# EAGLE design untitled (EAGLE 5.06)
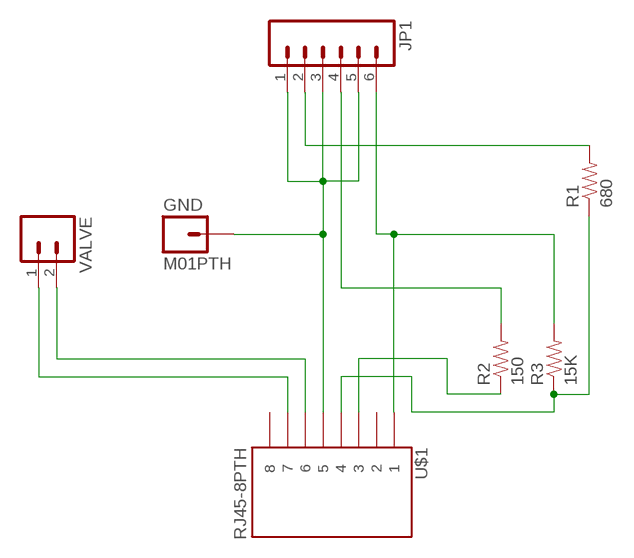
[diagram p0: schematic, sheet 1]

## Parts
GND  M01PTH  [1X01]
JP1  M063.5MM-6  [SCREWTERMINAL-3.5MM-6]
R1  680  RESISTORPTH-1/4W  [AXIAL-0.4]
R2  150  RESISTORPTH-1/4W  [AXIAL-0.4]
R3  15K  RESISTORPTH-1/4W  [AXIAL-0.4]
U$1  RJ45-8PTH  [RJ45-8]
VALVE  M023.5MM_LOCK  [SCREWTERMINAL-3.5MM-2_LOCK]

## Nets
N$1: JP1.6 R3.P$2 U$1.1
N$2: R1.P$1 R3.P$1 U$1.4
N$3: JP1.2 R1.P$2
N$4: GND.1 JP1.1 JP1.3 JP1.5 U$1.5
N$5: U$1.6 VALVE.2
N$6: U$1.7 VALVE.1
N$7: JP1.4 R2.P$2
N$8: R2.P$1 U$1.3
Unconnected: U$1.2 U$1.8

## Library data of the parts
GND = SparkFun:M01: Header 1 Standard 1-pin 0.1" header. Use with straight break away headers (SKU : PRT-00116), right angle break away headers (PRT-00553), swiss pins (PRT-00743), machine pins (PRT-00117), and female headers (PRT-00115).
JP1 = SparkFun:M06: Header 6 Standard 6-pin 0.1" header. Use with straight break away headers (SKU : PRT-00116), right angle break away headers (PRT-00553), swiss pins (PRT-00743), machine pins (PRT-00117), and female headers (PRT-00115). Molex polarized connector foot print use with SKU : PRT-08094 with associated crimp pins and housings. NOTES ON THE VARIANTS LOCK and LOCK_LONGPADS... This footprint was designed to help hold the alignment of a through-hole component (i.e. 6-pin header) while soldering it into place. You may notice that each hole has been shifted either up or down by 0.005 of an inch from it's more standard position (which is a perfectly straight line). This slight alteration caused the pins (the squares in the middle) to touch the edges of the holes. Because they are alternating, it causes a "brace" to hold the component in place. 0.005 has proven to be the perfect amount of "off-center" position when using our standard breakaway headers. Although looks a little odd when you look at the bare footprint, once you have a header in there, the alteration is very hard to notice. Also, if you push a header all the way into place, it is covered up entirely on the bottom side. This idea of altering the position of holes to aid alignment will be further integrated into the Sparkfun Library for other footprints. It can help hold any component with 3 or more connection pins.
R1-R3 = SparkFun:RESISTOR: Resistor Basic schematic elements and footprints for 0603, 1206, and PTH resistors.
U$1 = SparkFun:RJ45-8: RJ45 Jack Simple RJ45, 8-pin connection - connector for common Cat5, Cat5e, and Cat6 Ethernet cables. Footprint not yet proven in production. Connector sku is PRT-00643; Breakout PCB sku is BOB-00716.
VALVE = SparkFun:M02: Header 2 Standard 2-pin 0.1" header. Use with straight break away headers (SKU : PRT-00116), right angle break away headers (PRT-00553), swiss pins (PRT-00743), machine pins (PRT-00117), and female headers (PRT-00115). Molex polarized connector foot print use with SKU : PRT-08233 with associated crimp pins and housings.

## Board
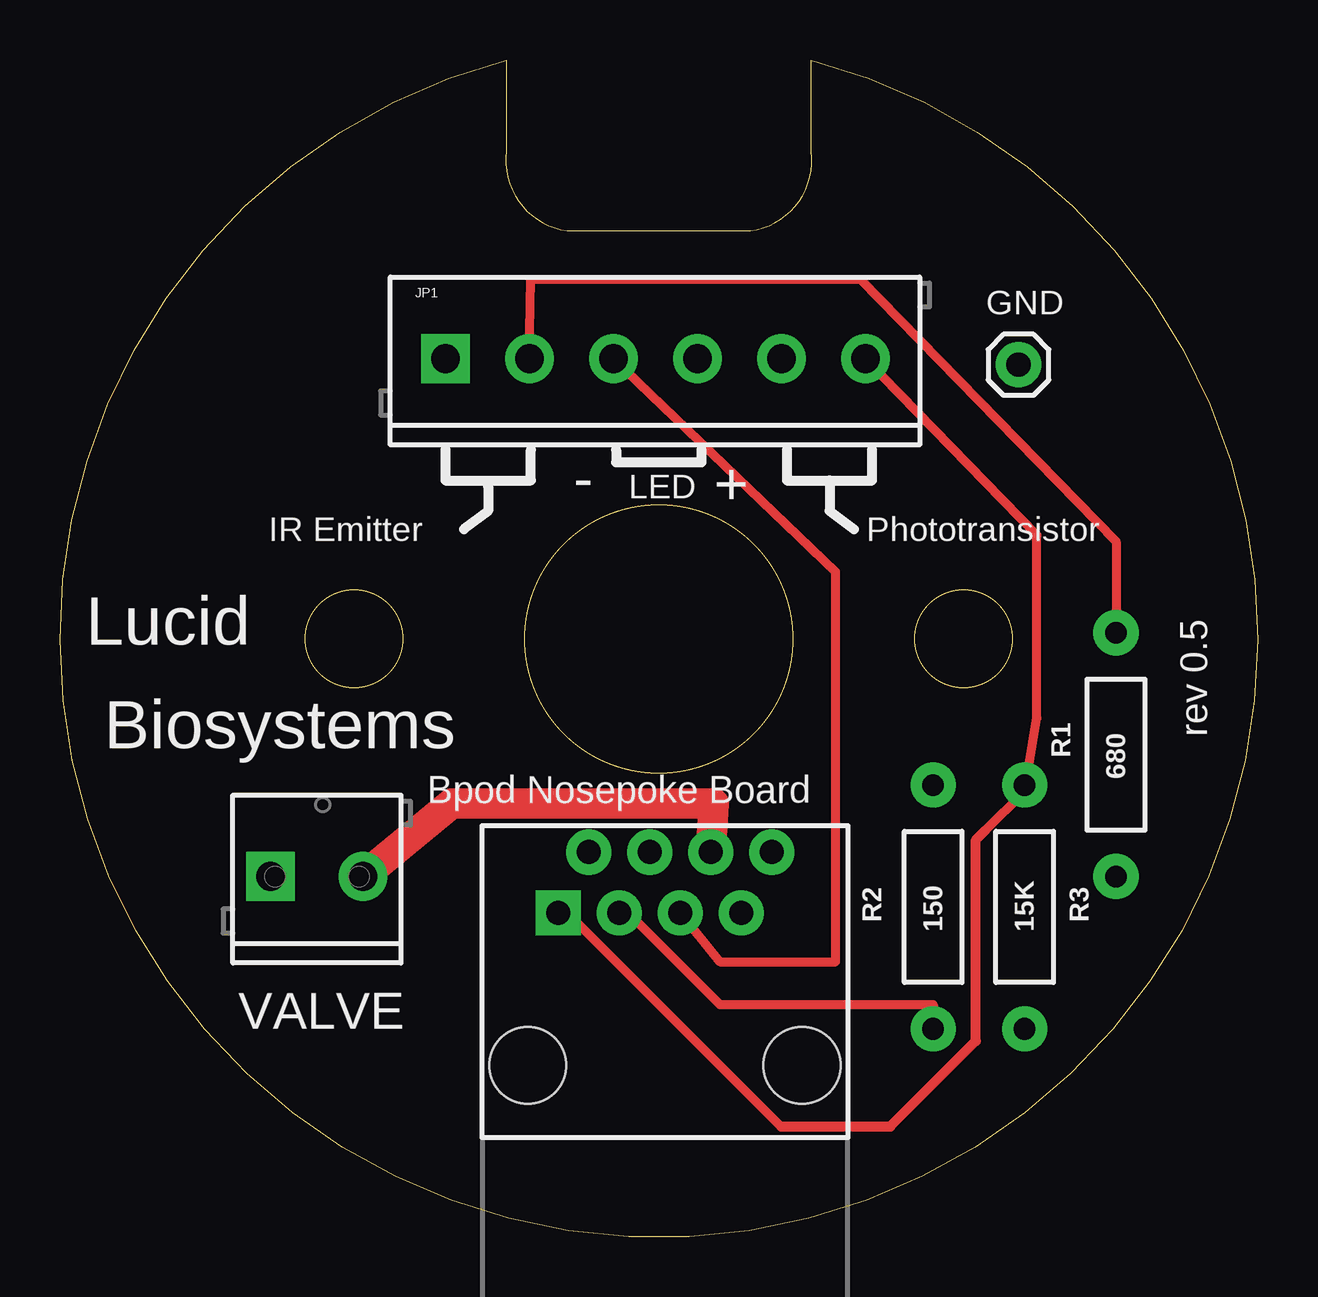
[diagram p1: board, top side]
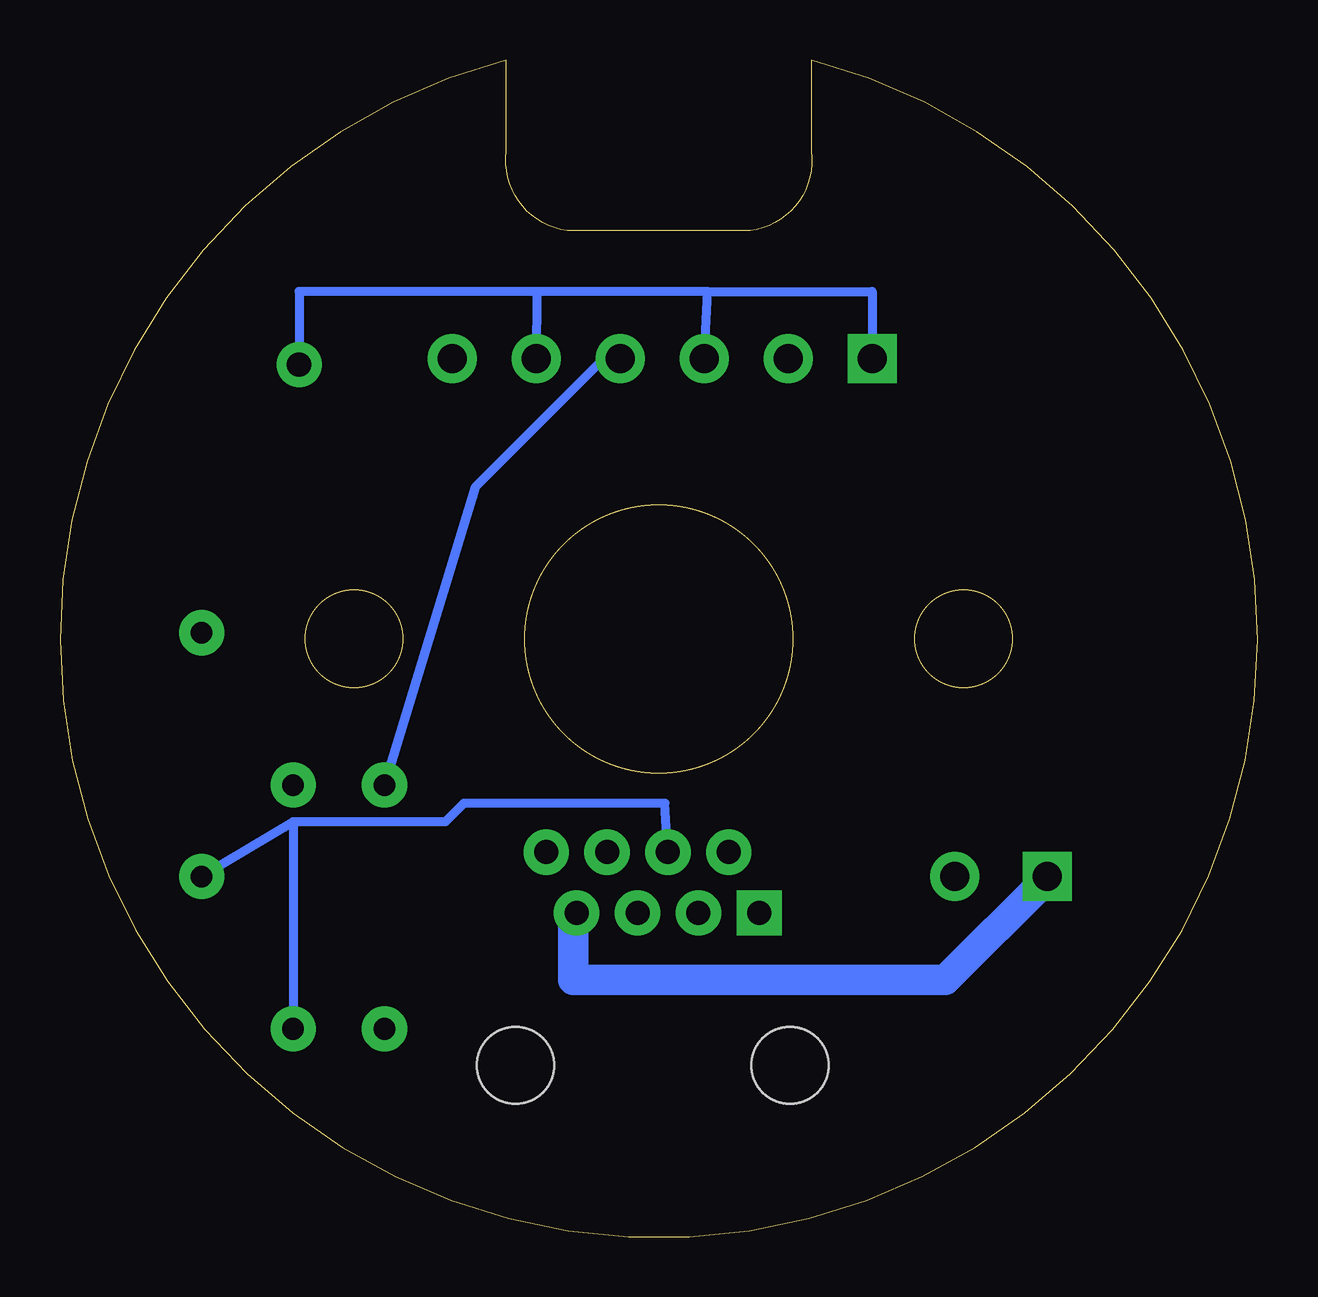
[diagram p2: board, bottom side, seen from below]

Size 49.9 x 49.05 mm. Coordinates in mm from the lower left corner, seen from the top.
Outline: 31.3,49.05 arc-331 18.6,49.05 18.6,45.24 arc90 21.14,41.94 28.76,41.94 arc90 31.3,45.24 31.3,49.05
Outline: circle at 24.95,24.92 radius 5.59
Outline: circle at 12.25,24.92 radius 2.03
Outline: circle at 37.65,24.92 radius 2.03
Copper layers (1*16): Top 0.035mm / dielectric 1.5mm / Bottom 0.035mm
Design rules "Fusion_eagle_rule_v1.1": minimum track width 6mil, minimum drill 12mil, track to track 6mil, track to pad 6mil, pad to pad 6mil, via to via 6mil, smd to smd 0mil, copper to edge 10mil, drill to drill 10mil, minimum pad ring 10mil, minimum via ring 6mil, stop-mask expansion 2mil, vias tented up to drill 100mil, thermal gap 10mil

### Footprints (pad centres in the part's own frame; a part is rotated, then mirrored left to right if it is on the bottom)
1X01 = drill 1.016 pad 1.88 round: 1 0,0
SCREWTERMINAL-3.5MM-6 = drill 1.2 pad 2.032 square: 1 0,0 | drill 1.2 pad 2.032 round: 2 3.5,0; 3 7,0; 4 10.5,0; 5 14,0; 6 17.5,0
AXIAL-0.4 = drill 0.9 pad 1.88 round: P$1 -5.08,0; P$2 5.08,0
RJ45-8 = drill 1 pad 1.88 square: 1 -4.445,6.35 | drill 1 pad 1.88 round: 2 -3.175,8.89; 3 -1.905,6.35; 4 -0.635,8.89; 5 0.635,6.35; 6 1.905,8.89; 7 3.175,6.35; 8 4.445,8.89 | hole 3.2: -5.715,0; 5.715,0
SCREWTERMINAL-3.5MM-2_LOCK = drill 1.2 pad 2.032 square: 1 -0.178,0 | drill 1.2 pad 2.032 round: 2 3.678,0

### Placement (x,y rotation side)
GND  39.94,36.35 0 top
JP1  16.06,36.6 0 top
R1  44,20.09 90 top
R2  36.38,13.74 90 top
R3  40.19,13.74 90 top
U$1  25.21,7.14 0 top
VALVE  8.95,15.01 0 top

### Tracks (layer width: path | path; a pad name or v marks a point on that pad's centre or on a via)
N$1
  Top 0.152: 40.19,18.57 R3.P$2
  Top 0.381: 30.03,4.6 21.14,13.49 U$1.1 | 33.84,36.35 JP1.6 40.7,29.24 40.7,21.62 40.19,18.57 38.54,16.92
  Top 0.406: 30.03,4.6 34.6,4.6 38.16,8.16 38.16,16.54 38.54,16.92
N$2
  Bottom 0.152: R3.P$1 40.19,8.41
  Bottom 0.381: 40.19,17.3 R3.P$1 | 40.19,17.3 33.84,17.3 33.08,18.06 24.7,18.06 U$1.4 | 40.19,17.3 R1.P$1
  Bottom 0.406: U$1.4 24.19,16.03
N$3
  Top 0.381: R1.P$2 44,28.98 33.33,39.91 19.62,39.91 JP1.2
N$4
  Top 0.381: JP1.3 32.32,27.71 32.32,11.46 27.49,11.46 U$1.5
  Bottom 0.152: JP1.5 30.03,36.35
  Bottom 0.381: JP1.1 16.06,39.4 22.92,39.4 | JP1.3 22.92,39.4 | 22.92,39.4 30.03,39.4 | 30.03,39.4 JP1.5 | GND.1 39.94,39.4 30.03,39.4
N$5
  Top 1.27: VALVE.2 16.32,18.06 27.24,18.06 U$1.6
N$6
  Bottom 1.27: VALVE.1 8.77,14.94 13.01,10.7 28.51,10.7 28.51,13.36 U$1.7
N$7
  Bottom 0.381: JP1.4 27.49,36.35 32.57,31.27 R2.P$2
N$8
  Top 0.381: U$1.3 23.68,13.49 27.49,9.68 36.38,9.68 R2.P$1 36.38,8.41

### Text on the board
tPlace: - | LED | + | IR Emitter | Phototransistor | Lucid | Biosystems | rev 0.5 | Bpod Nosepoke Board